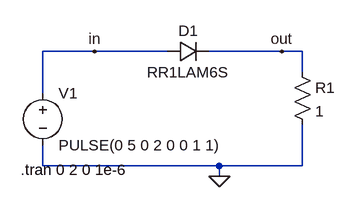
[diagram p0: schematic sim_1.asc]
sim_1.asc, the LTspice schematic file:
Version 4
SHEET 1 880 680
WIRE 112 160 32 160
WIRE 224 160 112 160
WIRE 400 160 288 160
WIRE 432 160 400 160
WIRE 432 192 432 160
WIRE 32 224 32 160
WIRE 32 336 32 304
WIRE 304 336 32 336
WIRE 432 336 432 272
WIRE 432 336 304 336
WIRE 304 352 304 336
FLAG 112 160 in
FLAG 400 160 out
FLAG 304 352 0
SYMBOL diode 224 176 R270
WINDOW 0 32 32 VTop 2
WINDOW 3 0 32 VBottom 2
SYMATTR InstName D1
SYMATTR Value RR1LAM6S
SYMBOL res 416 176 R0
SYMATTR InstName R1
SYMATTR Value 1
SYMBOL voltage 32 208 R0
WINDOW 123 0 0 Left 0
WINDOW 39 0 0 Left 0
SYMATTR InstName V1
SYMATTR Value PULSE(0 5 0 2 0 0 1 1)
TEXT -2 342 Left 2 !.tran 0 2 0 1e-6

The netlist it stands for:
* sim_1.asc
D1 in out RR1LAM6S
R1 out 0 1
V1 in 0 PULSE(0 5 0 2 0 0 1 1)
.model D D
.lib standard.dio
.tran 0 2 0 1e-6
.backanno
.end